# EAGLE schematic DAPlink-LPC11U35-v1.1.0 (EAGLE 7.7.0)
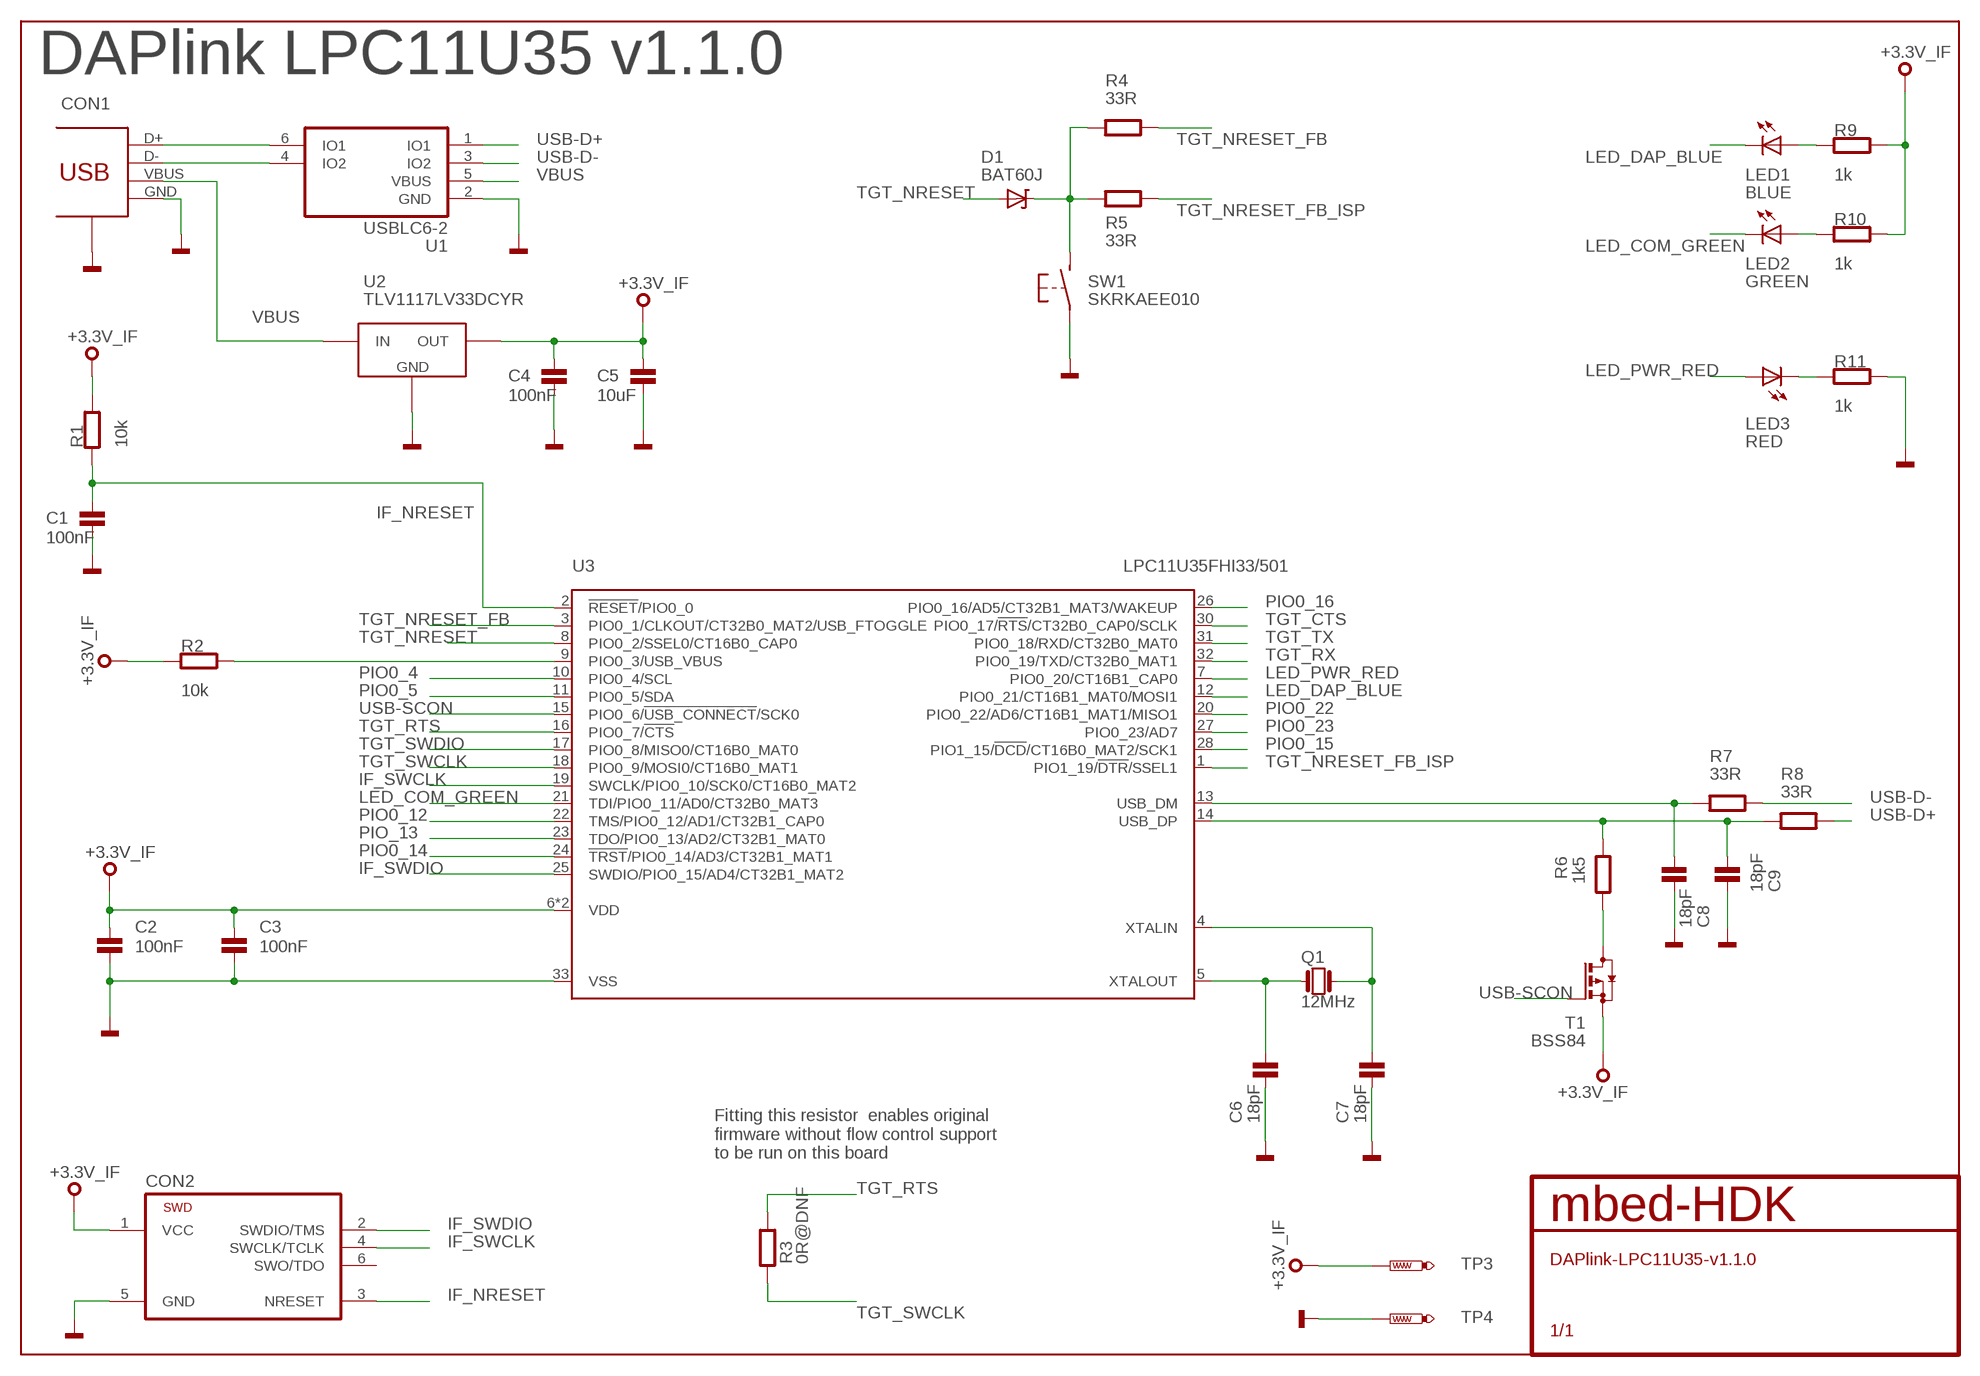
[diagram p0: schematic, sheet 1]

## Parts
C1  100nF  C0603  [0603]
C2  100nF  C0603  [0603]
C3  100nF  C0603  [0603]
C4  100nF  C0603  [0603]
C5  10uF  C0603  [0603]
C6  18pF  C0603  [0603]
C7  18pF  C0603  [0603]
C8  18pF  C0603  [0603]
C9  18pF  C0603  [0603]
CON1  47346-0001  [USB-MICRO-B-H]
CON2  TC2030-CTX-NL  [TC2030-CTX-NL]
D1  BAT60J  [SOD323]
LED1  BLUE  LED0603  [CHIPLED_0603]
LED2  GREEN  LED0603  [CHIPLED_0603]
LED3  RED  LED0603  [CHIPLED_0603]
Q1  12MHz  Q_3.2X2.5  [3.2X.2.5]
R1  10k  R0603  [0603]
R2  10k  R0603  [0603]
R3  0R@DNF  R0603  [0603]
R4  33R  R0603  [0603]
R5  33R  R0603  [0603]
R6  1k5  R0603  [0603]
R7  33R  R0603  [0603]
R8  33R  R0603  [0603]
R9  1k  R0603  [0603]
R10  1k  R0603  [0603]
R11  1k  R0603  [0603]
SW1  SKRKAEE010  [SKRKAEE010]
T1  BSS84  [SOT23-3]
TP3  PTR1TP07R  [TP07R]
TP4  PTR1TP07R  [TP07R]
U1  USBLC6-2SC6  [SOT23-6L]
U2  TLV1117LV33DCYR  [SOT223]
U3  LPC11U35FHI33/501  [SOT617-3]

## Nets
+3.3V_IF: C2.1 C3.1 C4.1 C5.1 CON2.1(VCC) R1.2 R2.1 R9.2 R10.2 T1.2(S) TP3.TP U2.2(OUT) U2.4(OUT) U3.6(VDD) U3.29(VDD)
GND: C1.2 C2.2 C3.2 C4.2 C5.2 C6.2 C7.2 C8.2 C9.2 CON1.GND CON1.GND1(SHEILD) CON1.GND2(SHEILD) CON1.GND3(SHEILD) CON1.GND4(SHEILD) CON2.5(GND) R11.2 SW1.P$1(P) TP4.TP U1.2(GND) U2.1(GND) U3.33(VSS)
IF_NRESET: C1.1 CON2.3(NRESET) R1.1 U3.2(!RESET!/PIO0_0)
IF_SWCLK: CON2.4(SWCLK/TCLK) U3.19(SWCLK/PIO0_10/SCK0/CT16B0_MAT2)
IF_SWDIO: CON2.2(SWDIO/TMS) U3.25(SWDIO/PIO0_15/AD4/CT32B1_MAT2)
LED_COM_GREEN: LED2.C U3.21(TDI/PIO0_11/AD0/CT32B0_MAT3)
LED_DAP_BLUE: LED1.C U3.12(PIO0_21/CT16B1_MAT0/MOSI1)
LED_PWR_RED: LED3.A U3.7(PIO0_20/CT16B1_CAP0)
N$1: LED3.C R11.1
N$2: CON1.D+ U1.6(IO1)
N$3: LED2.A R10.1
N$5: CON1.D- U1.4(IO2)
N$7: LED1.A R9.1
N$18: C6.1 Q1.P$1 U3.5(XTALOUT)
N$19: C7.1 Q1.P$3 U3.4(XTALIN)
N$20: R2.2 U3.9(PIO0_3/USB_VBUS)
N$23: R6.1 T1.3(D)
PIO0_4: U3.10(PIO0_4/SCL)
PIO0_5: U3.11(PIO0_5/SDA)
PIO0_12: U3.22(TMS/PIO0_12/AD1/CT32B1_CAP0)
PIO0_14: U3.24(!TRST!/PIO0_14/AD3/CT32B1_MAT1)
PIO0_15: U3.28(PIO1_15/!DCD!/CT16B0_MAT2/SCK1)
PIO0_16: U3.26(PIO0_16/AD5/CT32B1_MAT3/WAKEUP)
PIO0_22: U3.20(PIO0_22/AD6/CT16B1_MAT1/MISO1)
PIO0_23: U3.27(PIO0_23/AD7)
PIO_13: U3.23(TDO/PIO0_13/AD2/CT32B1_MAT0)
TGT_CTS: U3.30(PIO0_17/!RTS!/CT32B0_CAP0/SCLK)
TGT_NRESET: D1.A U3.8(PIO0_2/SSEL0/CT16B0_CAP0)
TGT_NRESET_BUTTON: D1.K R4.2 R5.2 SW1.P$2(S)
TGT_NRESET_FB: R4.1 U3.3(PIO0_1/CLKOUT/CT32B0_MAT2/USB_FTOGGLE)
TGT_NRESET_FB_ISP: R5.1 U3.1(PIO1_19/!DTR!/SSEL1)
TGT_RTS: R3.2 U3.16(PIO0_7/!CTS!)
TGT_RX: U3.32(PIO0_19/TXD/CT32B0_MAT1)
TGT_SWCLK: R3.1 U3.18(PIO0_9/MOSI0/CT16B0_MAT1)
TGT_SWDIO: U3.17(PIO0_8/MISO0/CT16B0_MAT0)
TGT_TX: U3.31(PIO0_18/RXD/CT32B0_MAT0)
USB-D+: R8.1 U1.1(IO1)
USB-D-: R7.1 U1.3(IO2)
USB-SCON: T1.1(G) U3.15(PIO0_6/!USB_CONNECT!/SCK0)
USB_DM: C8.1 R7.2 U3.13(USB_DM)
USB_DP: C9.1 R6.2 R8.2 U3.14(USB_DP)
VBUS: CON1.VBUS U1.5(VBUS) U2.3(IN)
Unconnected: CON2.6(SWO/TDO)

## Notes on the sheet
- DAPlink LPC11U35 v1.1.0
- Fitting this resistor  enables original
  firmware without flow control support
  to be run on this board

## Library data of the parts
C1-C9 = mbed-HDK-RLC:C: Capacitor
CON1 = mbed-HDK-Connector:47346-0001: USB Receptacle Horizontal Micro Type B; MF: MOLEX; MFN: 47346-0001; OC-DIGIKEY: WM17141CT-ND; OC-MOUSER: 538-47346-0001; OC-NEWARK: 1568026
CON2 = mbed-HDK-Connector:TC2030-CTX: Tag-Connect In Circuit Programming & Debug Cable 6 Pin
D1 = mbed-HDK-Discrete:BAT60J: SCHOTTKY DIODE; MF: STMicroelectronics; MFN: BAT60JFILM; OC-DIGIKEY: 497-3707-6-ND; OC-MOUSER: 511-BAT60JFILM; OC-NEWARK: 89K1218
LED1-LED3 = mbed-HDK-Optical:LED: LED SMD
Q1 = mbed-HDK-Oscillator:Q: Generic Crystal
R1-R11 = mbed-HDK-RLC:R: Resistor
SW1 = mbed-HDK-Switch:SKRKAEE010: MOMENTARY SWITCH PUSH VERTICAL (SPST); MF: ALPS; MFN: SKRKAEE010; OC-MOUSER: 688-SKRKAE
T1 = mbed-HDK-Discrete:BSS84: MOSFET P-CHANNEL; MF: Fairchild Semiconductor; MFN: BSS84; OC-DIGIKEY: BSS84CT-ND; OC-MOUSER: 512-BSS84; OC-NEWARK: 58K8770
TP3 TP4 = mbed-HDK-Test:PTR1: TEST PIN
U1 = mbed-HDK-IC:USBLC6-2
U2 = mbed-HDK-Power:TLV1117LV33DCYR: LDO Fixed Regulator 3.3v, 1A; MF: Texas Instruments; MFN: TLV1117LV33DCYR; OC-DIGIKEY: 296-28778-1-ND; OC-MOUSER: 595-TLV1117LV33DCYR; OC-NEWARK: 2323647
U3 = mbed-HDK-MF-NXP:LPC11U35FHI33: 32 Bit Microcontroller, ARM Cortex-M0, 50 MHz, 64 KB, 12 KB, 33 Pins, HVQFN; MF: NXP; MFN: LPC11U35FHI33/501; OC-DIGIKEY: 568-9586-ND; OC-MOUSER: 771-LPC11U35FHI33501; OC-NEWARK: 2115658